# EAGLE schematic lcd-i2c (EAGLE 6.4)
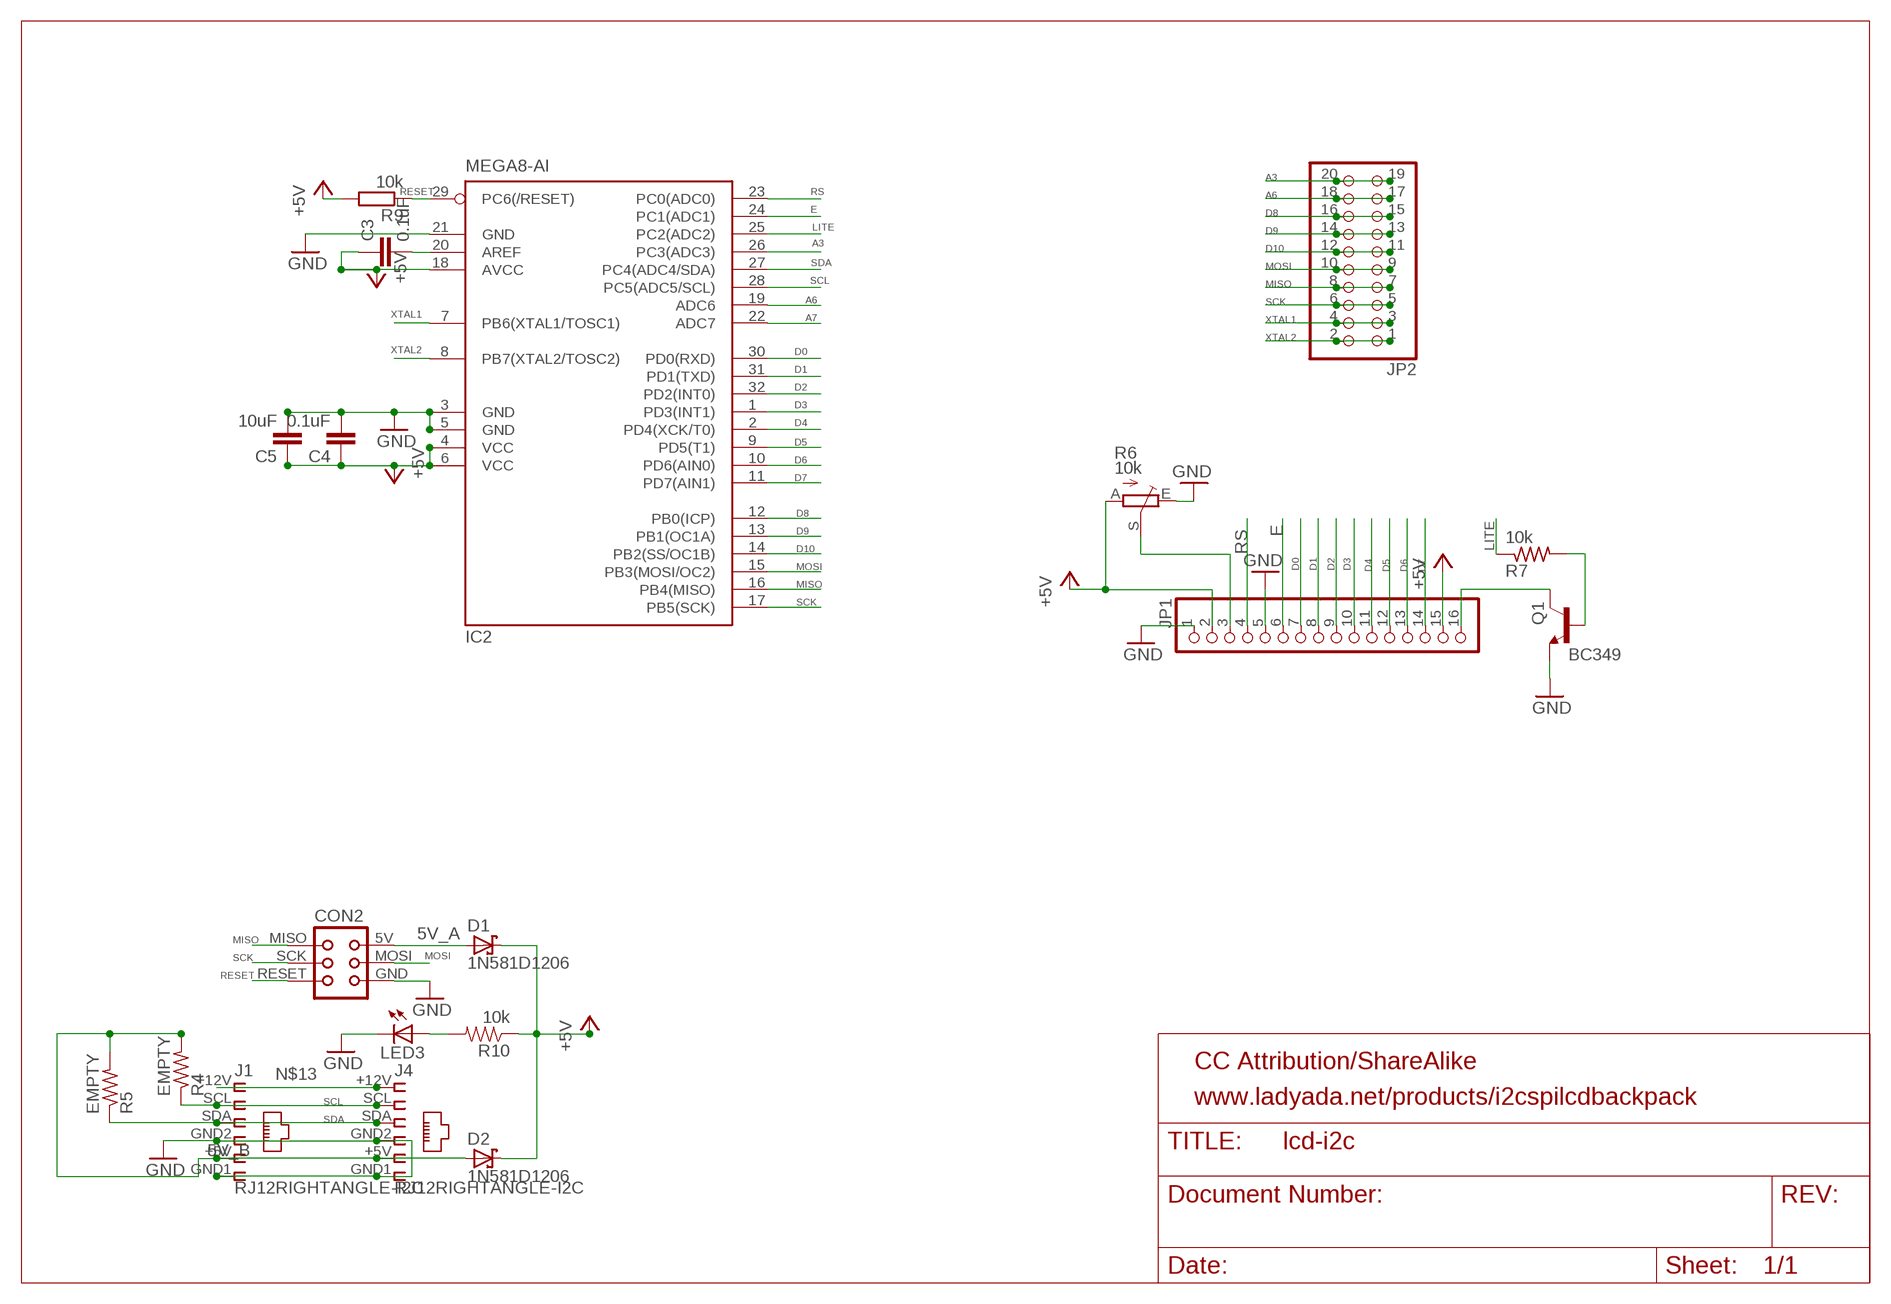
[diagram p0: schematic, sheet 1]

## Parts
C3  0.1uF  C-EUC1206  [C1206]
C4  0.1uF  C-EUC1206  [C1206]
C5  10uF  C-EUC1206  [C1206]
CON2  TINYISPTAG  [TC2030-MCP]
D1  1N581D1206  [LED-1206]
D2  1N581D1206  [LED-1206]
IC2  MEGA8-AI  [TQFP32-08]
J1  RJ12RIGHTANGLE-I2C  [RJ12-RIGHTANGLE-I2C]
J4  RJ12RIGHTANGLE-I2C  [RJ12-RIGHTANGLE-I2C]
JP1  PINHD-1X16  [1X16]
JP2  PINHD-2X10  [2X10]
LED3  LEDCHIP-LED0603  [CHIP-LED0603]
Q1  BC349  BC317-NPN-TO92-EBC  [TO92-EBC]
R4  EMPTY  R-US_M1206  [M1206]
R5  EMPTY  R-US_M1206  [M1206]
R6  10k  TRIM_EU-CA6V  [CA6V]
R7  10k  R-US_M1206  [M1206]
R9  10k  R-EU_M1206  [M1206]
R10  10k  RESISTOR0603-RES  [0603-RES]

## Nets
5V_A [i2c]: CON2.5V(VCC) D1.A
5V_B [power]: D2.A J1.+5V J4.+5V R4.2 R5.2
+5V [power]: C3.1 C4.1 C5.1 D1.C D2.C IC2.4(VCC) IC2.6(VCC) IC2.18(AVCC) JP1.2 JP1.15 R6.A R9.2 R10.1
A3: IC2.26(PC3(ADC3)) JP2.19 JP2.20
A6: IC2.19(ADC6) JP2.17 JP2.18
A7: IC2.22(ADC7)
D0: IC2.30(PD0(RXD)) JP1.7
D1: IC2.31(PD1(TXD)) JP1.8
D2: IC2.32(PD2(INT0)) JP1.9
D3: IC2.1(PD3(INT1)) JP1.10
D4: IC2.2(PD4(XCK/T0)) JP1.11
D5: IC2.9(PD5(T1)) JP1.12
D6: IC2.10(PD6(AIN0)) JP1.13
D7: IC2.11(PD7(AIN1)) JP1.14
D8: IC2.12(PB0(ICP)) JP2.15 JP2.16
D9: IC2.13(PB1(OC1A)) JP2.13 JP2.14
D10: IC2.14(PB2(SS/OC1B)) JP2.11 JP2.12
E: IC2.24(PC1(ADC1)) JP1.6
GND [power]: C4.2 C5.2 CON2.GND IC2.3(GND) IC2.5(GND) IC2.21(GND) J1.GND1 J1.GND2 J4.GND1 J4.GND2 JP1.1 JP1.5 LED3.C Q1.E R6.E
LITE: IC2.25(PC2(ADC2)) R7.1
MISO: CON2.MISO IC2.16(PB4(MISO)) JP2.7 JP2.8
MOSI: CON2.MOSI IC2.15(PB3(MOSI/OC2)) JP2.9 JP2.10
N$6: C3.2 IC2.20(AREF)
N$7: JP1.16 Q1.C
N$9: Q1.B R7.2
N$10: JP1.3 R6.S
N$13: J1.+12V J4.+12V
N$15: LED3.A R10.2
RESET: CON2.RESET IC2.29(PC6(/RESET)) R9.1
RS: IC2.23(PC0(ADC0)) JP1.4
SCK: CON2.SCK IC2.17(PB5(SCK)) JP2.5 JP2.6
SCL [i2c]: IC2.28(PC5(ADC5/SCL)) J1.SCL J4.SCL R4.1
SDA [i2c]: IC2.27(PC4(ADC4/SDA)) J1.SDA J4.SDA R5.1
XTAL1: IC2.7(PB6(XTAL1/TOSC1)) JP2.3 JP2.4
XTAL2: IC2.8(PB7(XTAL2/TOSC2)) JP2.1 JP2.2

## Notes on the sheet
- CC Attribution/ShareAlike
- www.ladyada.net/products/i2cspilcdbackpack

## Library data of the parts
C3-C5 = resistor:C-EU: CAPACITOR, European symbol
CON2 = lpatiny:TINYISP: CONNECTOR
D1 D2 = lpatiny:1N581*: 1.0A SCHOTTKY BARRIER RECTIFIER Source: http://www.diodes.com/datasheets/ds23001.pdf
IC2 = atmel:MEGA8: MICROCONTROLLER 8 Kbytes FLASH, 1 kbytes SRAM, 512 bytes EEPROM, USART, 6-channel 10 bit ADC, 2-channel 8 bit ADC Pin compatible with Atmega48, ATMega88, ATMega168 Source: avr.lbr; MPN: ATMEGA8-16AU; OC_FARNELL: 9171371; OC_NEWARK: 73M8863
J1 J4 = lpatiny:RJ12: CORCOM Modular RJ Jacks No Shield Source: www.tycoelectronics.com .. ENG_DS_1654001_1099_RJ_L_0507.pdf
JP1 = pinhead:PINHD-1X16: PIN HEADER
JP2 = pinhead:PINHD-2X10: PIN HEADER
LED3 = adafruit:LED: LED OSRAM: - CHIPLED LG R971, LG N971, LY N971, LG Q971, LY Q971, LO R971, LY R971 LH N974, LH R974 LS Q976, LO Q976, LY Q976 LO Q996 - Hyper CHIPLED LW Q18S LB Q993, LB Q99A, LB R99A - SideLED LS A670, LO A670, LY A670, LG A670, LP A670 LB A673, LV A673, LT A673, LW A673 LH A674 LY A675 LS A676, LA A676, LO A676, LY A676, LW A676 LS A679, LY A679, LG A679 - Hyper Micro SIDELED® LS Y876, LA Y876, LO Y876, LY Y876 LT Y87S - SmartLED LW L88C, LW L88S LB L89C, LB L89S, LG L890 LS L89K, LO L89K, LY L89K LS L896, LA L896, LO L896, LY L896 - TOPLED LS T670, LO T670, LY T670, LG T670, LP T670 LSG T670, LSP T670, LSY T670, LOP T670, LYG T670 LG T671, LOG T671, LSG T671 LB T673, LV T673, LT T673, LW T673 LH T674 LS T676, LA T676, LO T676, LY T676, LB T676, LH T676, LSB T676, LW T676 LB T67C, LV T67C, LT T67C, LS T67K, LO T67K, LY T67K, LW E67C LS E67B, LA E67B, LO E67B, LY E67B, LB E67C, LV E67C, LT E67C LW T67C LS T679, LY T679, LG T679 LS T770, LO T770, LY T770, LG T770, LP T770 LB T773, LV T773, LT T773, LW T773 LH T774 LS E675, LA E675, LY E675, LS T675 LS T776, LA T776, LO T776, LY T776, LB T776 LHGB T686 LT T68C, LB T68C - Hyper Mini TOPLED® LB M676 - Mini TOPLED Santana® LG M470 LS M47K, LO M47K, LY M47K Source: http://www.osram.convergy.de/
Q1 = transistor:*-NPN-: NPN Transistror BF959 corrected 2008.03.06
R4 R5 R7 = adafruit:R-US_: RESISTOR, American symbol
R6 = pot:TRIM_EU-: POTENTIOMETER
R9 = resistor:R-EU_: RESISTOR, European symbol
R10 = SparkFun:RESISTOR: Resistor Basic schematic elements and footprints for 0603, 1206, and PTH resistors.

## Net classes
0 default: width 0.305 mm
1 power: width 0.457 mm
2 i2c: width 0.305 mm